# Altium schematic sheet JacDacRHTemp 18.SchDoc: Complete design
size A4; DocumentNumber: 1; SheetNumber: 1; SheetTotal: 2; VersionControl_RevNumber: 1
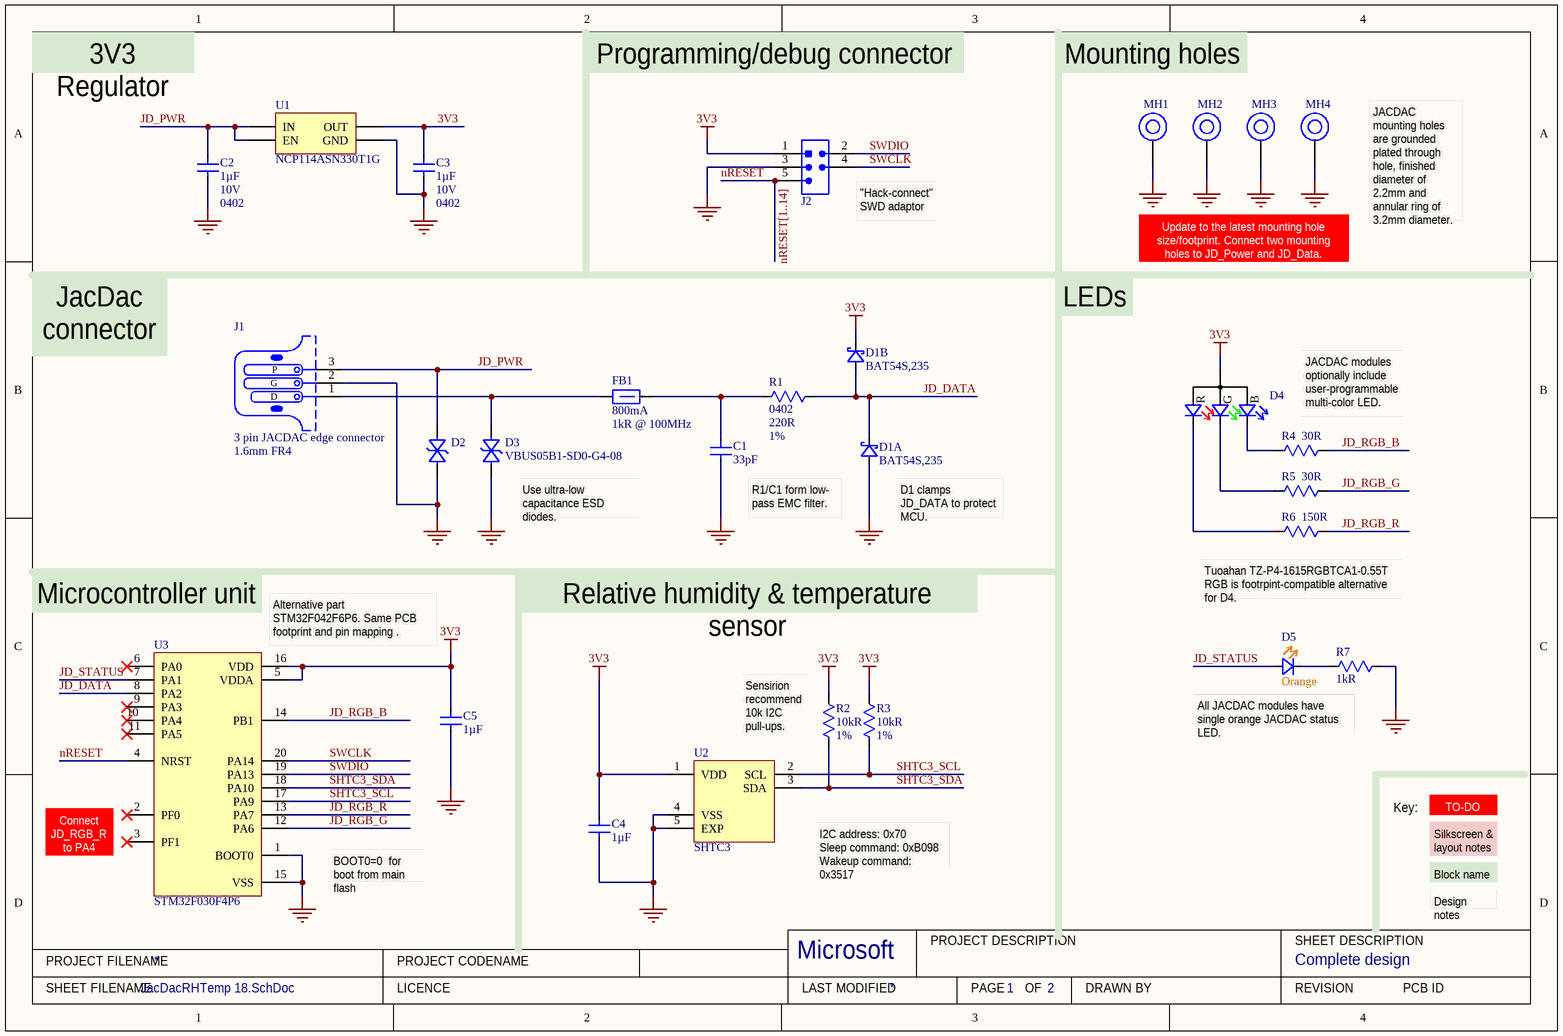
[diagram p0: JacDacRHTemp 18.SchDoc]

## Parts
C1  Capacitance: 33pF  [C0402_0.55MM - without outline]  (hidden comment: CL05C330JB51PNC)
C2  Capacitance: 1µF  Voltage Rating: 10V  Case Code (Imperial): 0402  [C0402_0.55MM - without outline]  (hidden comment: CL05A105KP5NNNC)
C3  Capacitance: 1µF  Voltage Rating: 10V  Case Code (Imperial): 0402  [C0402_0.55MM - without outline]  (hidden comment: CL05A105KP5NNNC)
C4  Capacitance: 1µF  [C0402_0.55MM - without outline]  (hidden comment: CL05A105KP5NNNC)
C5  Capacitance: 1µF  [C0402_0.55MM - without outline]  (hidden comment: CL05A105KP5NNNC)
D1  Manufacturer Part Number: BAT54S,235  [NXP-BAT54S-TO-236AB]  (hidden comment: BAT54S)  (parts A,B of 2)
D2  VBUS05B1-SD0-G4-08  [0201-VBUS05B1-SD0-G4-08 - Without outline]  (value not drawn)
D3  VBUS05B1-SD0-G4-08  [0201-VBUS05B1-SD0-G4-08 - Without outline]
D4  HSMF-C114  [HSMF-C114]  (value not drawn)
D5  Colour: Orange  [Rohm SML-D12 Orange - without outline]  (hidden comment: SML-D12D)
FB1  Current Rating: 800mA  Impedance: 1kR @ 100MHz  [TDK MPZ1608 0.8mm - without outline]  (hidden comment: TDK MPZ1608S102ATA00)
J1  3 pin JACDAC edge connector  PCB Type: 1.6mm FR4  [JACDAC_EDGE_CONNECTOR_9.15MM_PCB_WIDE _without_MH]  (no BOM)
J2  Hack Connect Mini 1.27 mm pitch 2-row  [HACK_CONNECT_MINI_5_X_1_27]  (value not drawn)  (no BOM)
MH1  MH_3.9MMNC_2.2MMD  [MH_3.9MMC_2.2MMD_FULL_CIRCLE]  (value not drawn)  (no BOM)
MH2  MH_3.9MMNC_2.2MMD  [MH_3.9MMC_2.2MMD_FULL_CIRCLE]  (value not drawn)  (no BOM)
MH3  MH_3.9MMNC_2.2MMD  [MH_3.9MMC_2.2MMD_FULL_CIRCLE]  (value not drawn)  (no BOM)
MH4  MH_3.9MMNC_2.2MMD  [MH_3.9MMC_2.2MMD_FULL_CIRCLE]  (value not drawn)  (no BOM)
R1  Case Code (Imperial): 0402  Resistance: 220R  Tolerance: 1%  [R0402 - Without outline]  (hidden comment: RC0402FR-07220RL)
R2  Resistance: 10kR  Tolerance: 1%  [R0402 - Without outline]  (hidden comment: 10k)
R3  Resistance: 10kR  Tolerance: 1%  [R0402 - Without outline]  (hidden comment: 10k)
R4  Resistance: 30R  [R0402 - Without outline]  (hidden comment: RC0402FR-0730RL)
R5  Resistance: 30R  [R0402 - Without outline]  (hidden comment: RC0402FR-0730RL)
R6  Resistance: 150R  [R0402 - Without outline]  (hidden comment: RC0402FR-07150RL)
R7  Resistance: 1kR  [R0402 - Without outline]  (hidden comment: RC0402FR-071KL)
U1  LDO 3.3V/300 mA  [ON_SEMI-SOT23-5]  (value not drawn)
U2  SHTC3  [SHTC3_4_WDFN]
U3  STM32F030F4P6  [20-TSSOP]

## Nets
3V3: C3.2 C4.2 C5.2 D1.2(K) D4.1(A) J2.1(VCC) R2.1 R3.1 U1.5(OUT) U2.1(VDD) U3.5(VDDA) U3.16(VDD)
GND: C1.1 C2.1 C3.1 C4.1 C5.1 D1.1(A) D2.2(A) D3.2(A) J1.2(G) J2.3(GND) MH1.1 MH2.1 MH3.1 MH4.1 R7.1 U1.2(GND) U2.4(VSS) U2.5(EXP) U3.1(BOOT0) U3.15(VSS)
JD_DATA: D1.3(K) R1.1 U3.8(PA2)
JD_PWR: C2.2 D2.1(K) J1.3(P) U1.1(IN) U1.3(EN)
JD_RGB_B: R4.2 U3.14(PB1)
JD_RGB_G: R5.2 U3.12(PA6)
JD_RGB_R: R6.2 U3.13(PA7)
JD_STATUS: D5.2(A) U3.7(PA1)
nRESET: J2.5(RESET) U3.4(NRST)  [also labelled nRESET[1..14]]
SHTC3_SCL: R3.2 U2.2(SCL) U3.17(PA9)
SHTC3_SDA: R2.2 U2.3(SDA) U3.18(PA10)
SWCLK: J2.4(SWCLK) U3.20(PA14)
SWDIO: J2.2(SWDIO) U3.19(PA13)
NetC1_2: C1.2 FB1.2 R1.2
NetD3_1: D3.1(K) FB1.1 J1.1(D)
NetD4_2: D4.2(R) R6.1
NetD4_3: D4.3(G) R5.1
NetD4_4: D4.4(B) R4.1
NetD5_1: D5.1(K) R7.2

Not connected (* = marked no-connect by the designer): U3 2(PF0)* 3(PF1)* 6(PA0)* 9(PA3)* 10(PA4)* 11(PA5)*

## Notes on the sheet
- 3V3 Regulator
- Programming/debug connector
- Mounting holes
- (near J2) "Hack-connect" SWD adaptor
- JACDAC mounting holes are grounded plated through hole, finished diameter of 2.2mm and annular ring of 3.2mm diameter.
- LEDs
- Update to the latest mounting hole size/footprint. Connect two mounting holes to JD_Power and JD_Data.
- JacDac
  connector
- JACDAC modules optionally include user-programmable multi-color LED.
- (near D3) Use ultra-low capacitance ESD diodes.
- R1/C1 form low-
  pass EMC filter.
- (near D1) D1 clamps JD_DATA to protect MCU.
- Microcontroller unit
- (near U3) Alternative part STM32F042F6P6. Same PCB footprint and pin mapping .
- Relative humidity & temperature sensor
- (near R6) Tuoahan TZ-P4-1615RGBTCA1-0.55T RGB is footrpint-compatible alternative for D4.
- Sensirion recommend 10k I2C pull-ups.
- All JACDAC modules have single orange JACDAC status LED.
- (near U3) Connect JD_RGB_R to PA4
- Key:
- TO-DO
- Silkscreen & layout notes
- BOOT0=0  for boot from main flash
- (near U2) I2C address: 0x70
  Sleep command: 0xB098
  Wakeup command: 0x3517
- Block name
- Design notes
- PROJECT FILENAME
- PROJECT CODENAME
- Microsoft
- PROJECT DESCRIPTION
- SHEET DESCRIPTION
- SHEET FILENAME
- LICENCE
- LAST MODIFIED
- PAGE
- OF
- DRAWN BY
- REVISION
- PCB ID

## Library data of the parts
C1 = CL05C330JB51PNC: CAP CER 33PF 50V NP0 0402; Manufacturer: Samsung; Tolerance: 5%; Supplier 1: Digi-Key; Manufacturer Part Number: CL05C330JB51PNC; RoHS: Yes; Category: Capacitors; Stock 1: 250654; Pricing 1: 1=0.10000, 10=0.07500, 50=0.04060, 100=0.03320, 500=0.02374, 1000=0.01865, 2500=0.01696, 5000=0.01560 (USD); Mount: Surface Mount; Case/Package: 0402; Case Code (Metric): 1005; Min Operating Temperature: -55°C; Max Operating Temperature: 125°C; Packaging: Tape and Reel; Length: 0.039inch; Width: 0.02inch; Thickness: 0.022inch; Ratings: AEC-Q200; Lead Free: Lead Free; ComponentLink1URL: http://www.samsungsem.com/kr/support/library/product-catalog/mlcc.jsp; ComponentLink1Description: Samsung datasheet online; Supplier 2: Mouser; Stock 2: 97900; Pricing 2: 1=0.11000, 10=0.08200, 100=0.03600, 500=0.02600, 1000=0.02000, 2500=0.01800 (USD); Supplier 3: Future Electronics; Stock 3: 100000; Pricing 3: 10000=0.00780 (USD); Supplier Part Number 3: 6022520; Supplier Part Number 2: 187-CL05C330JB51PNC; Checked: ?; Created: DG; Supplier Part Number 1: 1276-6515-1-ND; Voltage Rating: 50V; Case Code (Imperial): 0402
C2-C5 = CL05A105KP5NNNC: CAP CER 1UF 10V X5R 0402; Manufacturer: Samsung; Material: Ceramic; Tolerance: 10%; Supplier 1: Digi-Key; Manufacturer Part Number: CL05A105KP5NNNC; RoHS: Yes; Category: Capacitors; Stock 1: 5705569; Pricing 1: 1=0.10000, 10=0.03900, 50=0.02100, 100=0.01720, 500=0.01228, 1000=0.00965, 2500=0.00877, 5000=0.00807 (USD); Mount: Surface Mount; Case/Package: 0402; Case Code (Metric): 1005; Contact Plating: Tin; Min Operating Temperature: -55°C; Max Operating Temperature: 85°C; Dielectric: X5R; Package Quantity: 1; Packaging: Tape and Reel; Length: 1mm; Height: 0.5mm; Width: 0.02inch; Thickness: 0.022inch; Depth: 0.5mm; Radiation Hardening: No; ComponentLink1URL: https://datasheet.ciiva.com/15195/getdatasheetpartid-358390-15195630.pdf; ComponentLink1Description: Online datasheet; Supplier 2: Mouser; Stock 2: 928941; Pricing 2: 1=0.10000, 10=0.04200, 100=0.01800, 500=0.01300, 1000=0.01000, 2500=0.00900 (USD); Supplier 3: Farnell; Stock 3: 53670; Pricing 3: 10=0.02450, 100=0.02000, 500=0.01310, 2500=0.00920, 5000=0.00810, 10000=0.00640, 50000=0.00490 (GBP); Supplier Part Number 3: 3013329; Supplier Part Number 2: 187-CL05A105KP5NNNC; Supplier Part Number 1: 1276-1076-1-ND; Created: DG; Checked: ?
  C4 C5: Voltage Rating: 10V; Case Code (Imperial): 0402
D1 = BAT54S: DIODE ARRAY SCHOTTKY 30V SOT23; Manufacturer: Nexperia; Supplier 1: Digi-Key; RoHS: No; Category: Rectifier Diodes; Stock 1: 14011; Pricing 1: 1=0.13000, 10=0.11900, 100=0.05610, 500=0.03326, 1000=0.02185, 5000=0.02138 (USD); ComponentLink1URL: https://assets.nexperia.com/documents/data-sheet/BAT54_SER.pdf; ComponentLink1Description: NXP datasheet online; Supplier 2: Mouser; Supplier 3: RSComponents; Supplier Part Number 2: 771-BAT54S235; Supplier Part Number 3: 1707990; Supplier Part Number 1: 1727-1868-1-ND
D2 D3 = VBUS05B1-SD0-G4-08: TVS DIODE 5.5V 18V CLP0603; Manufacturer: Vishay Semiconductors; Peak Pulse Current: 2.5A; Number of Bidirectional Channels: 1; Min Breakdown Voltage: 6V; Peak Pulse Power: 45W; Power Line Protection: No; Direction: Bidirectional; Capacitance: 0.4pF; Element Configuration: Single; Supplier 1: Digi-Key; RoHS: Yes; Category: TVS Diodes; Stock 1: 22028; Pricing 1: 1=0.27000, 10=0.18500, 100=0.09020, 500=0.07524, 1000=0.05228, 2000=0.04531, 5000=0.04203 (USD); Mount: Surface Mount; Case/Package: 0201; Number of Pins: 2; Case Code (Metric): 0603; Case Code (Imperial): 0201; Min Operating Temperature: -55°C; Max Operating Temperature: 150°C; Packaging: Tape and Reel; Reverse Standoff Voltage: 5.5V; Clamping Voltage: 18V; Working Voltage: 5.5V; Resistor Type: Zener; ComponentLink2URL: http://www.vishay.com/docs/85899/vbus05b1-sd0.pdf; ComponentLink2Description: Online datasheet; Supplier 2: Farnell; Stock 2: 13100; Pricing 2: 5=0.20800, 10=0.14000, 100=0.06340, 500=0.05020, 1000=0.04160, 5000=0.03300 (GBP); Supplier 3: Mouser; Stock 3: 1209; Pricing 3: 1=0.27000, 10=0.18500, 50=0.18500, 100=0.09300, 1000=0.03900, 10000=0.03400 (USD); Supplier 4: Arrow Electronics; Stock 4: 719; Pricing 4: 1=0.17630, 10=0.14370, 25=0.14230, 100=0.07810, 250=0.07660, 500=0.06310, 15000=0.02980, 150000=0.02970, 1500000=0.02870, 7500000=0.02800 (USD); Supplier Part Number 4: VBUS05B1-SD0-G4-08; Supplier Part Number 3: 78-VBUS05B1SD0-G4-08; Supplier Part Number 1: VBUS05B1-SD0-G4-08GICT-ND; Supplier Part Number 2: 2932858; Created By: D. Gakure; Checked By: ?; Manufacturer Part Number: VBUS05B1-SD0-G4-08
D4 = HSMF-C114: Red, Green, Blue (RGB) 626nm Red, 525nm Green, 470nm Blue LED Indication - Discrete 1.9V Red, 3.4V Green, 3.4V Blue 0606 (1616 Metric); Manufacturer: Broadcom Avago; Color: Blue,Green,Red; Lens Color: White; Viewing Angle: 145°; Luminous Intensity: 70mcd; Lens Style: Diffused,Rectangular; Forward Current: 20mA; Lens Transparency: Diffused; Number of Elements: 3; Reverse Voltage: 5V; Power Rating: 78mW; Supplier 1: Digi-Key; Manufacturer Part Number: HSMF-C114; RoHS: Yes; Category: Optoelectronics; Stock 1: 20555; Pricing 1: 1=1.78000, 10=1.12500, 100=0.83250, 500=0.76500, 1000=0.63000, 2000=0.59850 (USD); Mount: Surface Mount; Case/Package: 0606; Number of Pins: 4; Case Code (Metric): 1616; Case Code (Imperial): 0606; Min Operating Temperature: -40°C; Max Operating Temperature: 85°C; Forward Voltage: 3.4V; Packaging: Tape and Reel; Wavelength: 470nm; Package Quantity: 4000; Dominant Wavelength: 470nm; Test Current: 20mA; Number of LEDs: 3; Length: 1.6mm; Width: 1.5mm; Height: 0.35mm; Depth: 1.6mm; Radiation Hardening: No; REACH SVHC: No SVHC; Lead Free: Lead Free; Supplier 2: Farnell; Stock 2: 8134; Pricing 2: 1=1.56000, 10=0.97100, 25=0.87800, 50=0.78500, 100=0.69200, 500=0.60500 (GBP); Supplier 3: Mouser; Stock 3: 14991; Pricing 3: 1=1.69000, 10=1.13000, 50=1.13000, 100=0.85600, 1000=0.74800, 10000=0.74800 (USD); Supplier Part Number 1: 516-1795-1-ND; Supplier Part Number 3: 630-HSMF-C114; Supplier Part Number 2: 1058362; ComponentLink1Description: Online datasheet; ComponentLink1URL: https://docs.broadcom.com/docs/AV02-2451EN; Created By: D. Gakure; Checked By: ?
D5 = SML-D12D: 1.6 x 0.8 x 0.55mm (0603) LED 605nm Orange; Manufacturer: Rohm Semiconductor; Manufacturer Part Number: SML-D12D8WT86; Millicandela Rating: 100mcd; Voltage - Forward (Vf) (Typ): 2.2V; Current - Test: 20mA; Lens Type: Diffused, White; Lens Style/Size: Rectangle with Flat Top, 1.2mm x 0.8mm; Supplier 1: Digi-Key; RoHS: RoHS Compliant; Category: Optoelectronics; Stock 1: 1719; Pricing 1: 1=0.38, 10=0.279, 25=0.2232, 100=0.1478, 250=0.1046, 500=0.08926, 1000=0.06974 (GBP); Packaging: Cut Tape (CT); Wavelength - Dominant: 605nm; Wavelength - Peak: -; Viewing Angle: -; Package / Case: 0603 (1608 Metric); Size / Dimension: 1.60mm L x 0.80mm W; Height: 0.55mm; Mounting Type: Surface Mount; Luminous Flux @ Current - Test: -; ComponentLink1URL: https://d1d2qsbl8m0m72.cloudfront.net/en/products/databook/datasheet/opto/led/chip_mono/sml-d12x8_d13x8-e.pdf; ComponentLink1Description: Online datasheet; Supplier Part Number 1: 511-1577-1-ND
FB1 = TDK MPZ1608S102ATA00: 0603 1k@100MHz 0.8A chip; Core Material: Ferrite; Tolerance: 25%; DC Resistance (DCR): 300mR; Supplier 1: Digi-Key; Stock 1: 113542; Pricing 1: 1=0.1, 10=0.079, 25=0.0716, 50=0.0644, 100=0.0472, 250=0.03432, 500=0.03146, 1000=0.02717 (USD); Mount: Surface Mount; Case/Package: 0603; Case Code (Metric): 1608; Case Code (Imperial): 0603; Package Quantity: 4000; Packaging: Tape and Reel; Max DC Current: 800mA; Length: 0.063inch; Height: 0.037inch; Width: 0.031inch; ComponentLink2URL: https://www.mouser.co.uk/datasheet/2/400/eads_commercial_power_mpz1608_en-923650.pdf; ComponentLink2Description: datasheet online; Supplier 2: Mouser; ComponentLink3Description: datasheet; ComponentLink3URL: Y:\System\Altium\Libraries 2014\TDK\Datasheets\eads_commercial_power_mpz1608_en-923650.pdf; Supplier Part Number 1: 445-8694-1-ND; Supplier Part Number 2: 810-MPZ1608S102ATA00; Manufacturer: TDK; Manufacturer Part Number: MPZ1608S102ATA00
J1 = JACDAC edge connector: 3 pin JACDAC edge connector 1.27mm pitch; Manufacturer Part Number: JACDAC_EDGE_CONNECTOR; Checked By: ?; Created By: D. Gakure; ComponentLink1Description: Yuliang JACDAC cable connector drawing online; ComponentLink1URL: https://github.com/microsoft/jacdac-mdk/blob/main/connector/JACDAC-Connector-by-Yuliang-2020-11-28.pdf; ComponentLink2Description: JACDAC PCB edge connector spec onlin; ComponentLink2URL: https://github.com/microsoft/jacdac-mdk/blob/main/connector/JACDAC_PCB_Edge_Connector_Drawing_JD-PEC-01_rev_01.pdf
J2 = HACK_CONNECT_MINI
MH1-MH4 = MH_3.9MMNC_2.2MMD_FULL_CIR: Mounting Hole 3.9mm Diameter with 3.2 annualar ring, 2.2mm Drill PTH
R1 = RC0402FR-07220RL: RES SMD 220 OHM 1% 1/16W 0402; Manufacturer: Yageo; Power Rating: 62.5mW; Voltage Rating: 50V; Temperature Coefficient: 100ppm/°C; Max Power Dissipation: 63mW; Supplier 1: Digi-Key; Manufacturer Part Number: RC0402FR-07220RL; RoHS: Yes; Category: Resistors; Stock 1: 1286042; Pricing 1: 1=0.10000, 10=0.01400, 100=0.00580, 1000=0.00262, 2500=0.00228, 5000=0.00188 (USD); Case/Package: 0402; Number of Pins: 2; Case Code (Metric): 1005; Min Operating Temperature: -55°C; Max Operating Temperature: 155°C; Packaging: Tape and Reel; Voltage Rating (DC): 50V; Package Quantity: 1; Termination: SMD/SMT; Resistor Type: Thick Film; Number of Terminations: 2; Features: Moisture Resistant; Length: 1mm; Height: 0.016inch; Width: 0.02inch; Depth: 0.5mm; REACH SVHC: No SVHC; Military Standard: Not; Lead Free: Lead Free; ComponentLink1URL: https://datasheet.ciiva.com/11819/0900766b80c66297-11819466.pdf?src-supplier=RSComponents; ComponentLink1Description: https://datasheet.ciiva.com/11819/0900766b80c66297-11819466.pdf?src-supplier=RSComponents; ComponentLink2URL: https://datasheet.ciiva.com/2453/pyu-r-int-thick-7-2453460.pdf?src-supplier=Digi-Key; ComponentLink2Description: https://datasheet.ciiva.com/2453/pyu-r-int-thick-7-2453460.pdf?src-supplier=Digi-Key; ComponentLink3URL: https://datasheet.ciiva.com/2453/pyu-r-int-thick-7-2453461.pdf?src-supplier=Digi-Key; ComponentLink3Description: https://datasheet.ciiva.com/2453/pyu-r-int-thick-7-2453461.pdf?src-supplier=Digi-Key; ComponentLink4URL: https://datasheet.ciiva.com/2453/pyu-r-int-thick-7-2453462.pdf?src-supplier=Digi-Key; ComponentLink4Description: https://datasheet.ciiva.com/2453/pyu-r-int-thick-7-2453462.pdf?src-supplier=Digi-Key; ComponentLink5URL: https://datasheet.ciiva.com/16746/pyu-rc0402-51-rohs-l-6-r-16746831.pdf?src-supplier=Future+Electronics; ComponentLink5Description: https://datasheet.ciiva.com/16746/pyu-rc0402-51-rohs-l-6-r-16746831.pdf?src-supplier=Future+Electronics; Supplier 2: Mouser; Stock 2: 324625; Pricing 2: 1=0.10000, 10=0.01200, 100=0.00400, 1000=0.00400, 2500=0.00400, 10000=0.00300 (USD); Supplier 3: Farnell; Stock 3: 18234; Pricing 3: 1=0.08130, 25=0.01210, 100=0.01120, 250=0.01030, 500=0.00900 (GBP); Supplier Part Number 3: 2147864; Supplier Part Number 2: 603-RC0402FR-07220RL; Supplier Part Number 1: 311-220LRCT-ND; Created: D.G; Checked: ?
R2 R3 = RC0402FR-0710KL: RES SMD 10K OHM 1% 1/16W 0402; Manufacturer: Yageo; Temperature Coefficient: 100ppm/°C; Voltage Rating (DC): 50V; Power Rating: 62.5mW; Supplier 1: Digi-Key; Manufacturer Part Number: RC0402FR-0710KL; RoHS: Yes; Category: Resistors; Stock 1: 40173593; Pricing 1: 1=0.10000, 10=0.01400, 100=0.00580, 1000=0.00262, 2500=0.00228, 5000=0.00188 (USD); Case/Package: 0402; Number of Pins: 2; Case Code (Metric): 1005; Min Operating Temperature: -55°C; Max Operating Temperature: 155°C; Resistor Type: Thick Film; Packaging: Tape and Reel; Voltage Rating: 50V; Termination: SMD/SMT; Working Voltage: 50V; Number of Terminations: 2; Length: 1mm; Height: 0.32mm; Width: 0.5mm; Depth: 0.5mm; Lead Pitch: 0.2mm; REACH SVHC: No SVHC; Lead Free: Lead Free; Military Standard: Not; ComponentLink1URL: https://datasheet.ciiva.com/7660/38568-7660787.pdf?src-supplier=Element14; ComponentLink1Description: https://datasheet.ciiva.com/7660/38568-7660787.pdf?src-supplier=Element14; ComponentLink2URL: https://datasheet.ciiva.com/7849/1784430-7849813.pdf?src-supplier=Element14; ComponentLink2Description: https://datasheet.ciiva.com/7849/1784430-7849813.pdf?src-supplier=Element14; ComponentLink3URL: https://datasheet.ciiva.com/7849/1686128-7849814.pdf?src-supplier=Element14; ComponentLink3Description: https://datasheet.ciiva.com/7849/1686128-7849814.pdf?src-supplier=Element14; ComponentLink4URL: https://datasheet.ciiva.com/7849/1784430-7849815.pdf?src-supplier=Element14; ComponentLink4Description: https://datasheet.ciiva.com/7849/1784430-7849815.pdf?src-supplier=Element14; ComponentLink5URL: https://datasheet.ciiva.com/22747/1018594-22747512.pdf?src-supplier=Element14; ComponentLink5Description: https://datasheet.ciiva.com/22747/1018594-22747512.pdf?src-supplier=Element14; ComponentLink6URL: https://datasheet.ciiva.com/12667/pyu-rc0402-51-rohs-l-6-r-12667067.pdf?src-supplier=Mouser; ComponentLink6Description: https://datasheet.ciiva.com/12667/pyu-rc0402-51-rohs-l-6-r-12667067.pdf?src-supplier=Mouser; ComponentLink7URL: https://datasheet.ciiva.com/7983/1018594-7983486.pdf?src-supplier=Element14; ComponentLink7Description: https://datasheet.ciiva.com/7983/1018594-7983486.pdf?src-supplier=Element14; Supplier 2: Mouser; Stock 2: 23672167; Pricing 2: 1=0.10000, 10=0.01300, 100=0.00400, 1000=0.00300, 2500=0.00300, 10000=0.00200 (USD); Supplier 3: Farnell; Stock 3: 370000; Pricing 3: 10000=0.00350 (GBP); Checked: ?; Created: DG; Supplier Part Number 1: 311-10.0KLRCT-ND; Supplier Part Number 2: 603-RC0402FR-0710KL; Supplier Part Number 3: 2363463; Case Code (Imperial): 0402
R4 R5 = RC0402FR-0730RL: RES SMD 30 OHM 1% 1/16W 0402; Manufacturer: Yageo; Temperature Coefficient: 100ppm/°C; Power Rating: 63mW; Voltage Rating: 50V; Supplier 1: Digi-Key; Manufacturer Part Number: RC0402FR-0730RL; RoHS: Yes; Category: Chip SMD Resistors; Stock 1: 2973; Pricing 1: 1=0.10000, 10=0.01400, 100=0.00580, 1000=0.00260, 2500=0.00226, 5000=0.00186 (USD); Case/Package: 0402; Contact Plating: Tin,Matte; Case Code (Metric): 1005; Size Code: 0402; Min Operating Temperature: -55°C; Max Operating Temperature: 155°C; Resistor Type: Thick Film; Packaging: Tape and Reel; Termination: SMD/SMT; Voltage Rating (DC): 50V; Features: Moisture Resistant; Series: RC; Max Power Dissipation: 63mW; Number of Terminations: 2; Construction: Rectangular; Resistance Tolerance: 1%; Length: 1mm; Width: 0.5mm; Height: 0.35mm; Depth: 0.5mm; REACH SVHC: Unknown; Military Standard: Not; Lead Free: Lead Free; RoHS Compliant: Yes; ComponentLink1URL: https://datasheet.ciiva.com/7849/1018594-7849958.pdf; ComponentLink1Description: Online datasheet; Supplier 2: Mouser; Stock 2: 41804; Pricing 2: 1=0.10000, 10=0.01200, 50=0.01200, 100=0.00400, 1000=0.00400, 10000=0.00300 (USD); Supplier 3: Farnell; Stock 3: 4422; Pricing 3: 10=0.01210, 100=0.00420, 500=0.00370, 2500=0.00280, 5000=0.00250, 10000=0.00230, 50000=0.00150 (GBP); Supplier Part Number 3: 1458775; Supplier Part Number 2: 603-RC0402FR-0730RL; Supplier Part Number 1: 311-30LRCT-ND; Created By: D. Gakure; Checked By: ?; Tolerance: 1%; Case Code (Imperial): 0402
R6 = RC0402FR-07150RL: RES SMD 150 OHM 1% 1/16W 0402; Manufacturer: Yageo; Power Rating: 62.5mW; Voltage Rating: 50V; Temperature Coefficient: 100ppm/°C; Max Power Dissipation: 63mW; Supplier 1: Digi-Key; Manufacturer Part Number: RC0402FR-07150RL; RoHS: Yes; Category: Chip SMD Resistors; Stock 1: 5214533; Pricing 1: 1=0.10000, 10=0.01400, 100=0.00580, 1000=0.00260, 2500=0.00226, 5000=0.00186 (USD); Case/Package: 0402; Case Code (Metric): 1005; Min Operating Temperature: -55°C; Max Operating Temperature: 155°C; Packaging: Tape and Reel; Package Quantity: 1; Resistor Type: Thick Film; Number of Terminations: 2; Termination: SMD/SMT; Working Voltage: 50V; Features: Moisture Resistant; Series: RC; Resistance Tolerance: 1%; Construction: Rectangular; Technology: THICK FILM; Length: 1mm; Width: 0.02inch; Height: 0.016inch; Depth: 0.5mm; REACH SVHC: No SVHC; Military Standard: Not; Lead Free: Lead Free; RoHS Compliant: Yes; ComponentLink1URL: https://datasheet.ciiva.com/11808/0900766b80c66297-11808422.pdf; ComponentLink1Description: ine datasheet; Supplier 2: Mouser; Stock 2: 582717; Pricing 2: 1=0.10000, 10=0.01200, 50=0.01200, 100=0.00400, 1000=0.00400, 10000=0.00300 (USD); Supplier 3: Farnell; Stock 3: 880000; Pricing 3: 10000=0.00270, 50000=0.00200 (GBP); Created by: D. Gakure; Checked By: ?; Supplier Part Number 3: 2421893; Supplier Part Number 2: 603-RC0402FR-07150RL; Supplier Part Number 1: 311-150LRCT-ND; Tolerance: 1%; Case Code (Imperial): 0402
R7 = RC0402FR-071KL: RES SMD 1K OHM 1% 1/16W 0402; Manufacturer: Yageo; Temperature Coefficient: 100ppm/°C; Voltage Rating (DC): 50V; Power Rating: 62.5mW; Supplier 1: Digi-Key; Manufacturer Part Number: RC0402FR-071KL; RoHS: Yes; Category: Resistors; Stock 1: 37591306; Pricing 1: 1=0.10000, 10=0.01400, 100=0.00580, 1000=0.00262, 2500=0.00228, 5000=0.00188 (USD); Case/Package: 0402; Number of Pins: 2; Case Code (Imperial): 0402; Case Code (Metric): 1005; Min Operating Temperature: -55°C; Max Operating Temperature: 155°C; Resistor Type: Thick Film; Tolerance: 1%; Packaging: Tape and Reel; Voltage Rating: 50V; Termination: SMD/SMT; Length: 1mm; Height: 0.32mm; Width: 0.5mm; Depth: 0.5mm; REACH SVHC: Unknown; Lead Free: Lead Free; Military Standard: Not; ComponentLink2URL: https://datasheet.ciiva.com/12666/pyu-rc0402-51-rohs-l-6-r-12666741.pdf; ComponentLink2Description: Online datasheet; Supplier 2: Mouser; Stock 2: 11912978; Pricing 2: 1=0.10000, 10=0.01200, 100=0.00400, 1000=0.00400, 2500=0.00400, 10000=0.00300 (USD); Supplier 3: Farnell; Stock 3: 29900; Pricing 3: 1=0.08130, 25=0.01210, 100=0.01120, 250=0.01030, 500=0.00900 (GBP); Supplier Part Number 3: 2132441; Supplier Part Number 2: 603-RC0402FR-071KL; Supplier Part Number 1: 311-1.00KLRDKR-ND; Created: D.G; Checked: ?
U1 = NCP114ASN330T1G: ON SEMICONDUCTOR - NCP114ASN330T1G - LDO Voltage Regulator, Fixed, 1.7 V to 5.5 V in, 3.3 V/300 mA out, 150 mV drop, TSOP-5; Output Current: 300mA; Output Configuration: Positive; Number of Regulators: 1; Max Input Voltage: 5.5V; Min Output Voltage: 3.3V; Dropout Voltage: 225mV; Quiescent Current: 95uA; Power Supply Rejection Ratio (PSRR): 75dB; Supplier 1: Digi-Key; RoHS: No; Category: Voltage Regulators - Linear; Stock 1: 32529; Pricing 1: 1=0.33000, 10=0.24900, 25=0.21760, 100=0.12440, 250=0.11664, 500=0.09330, 1000=0.07153 (USD); Mount: Surface Mount; Case/Package: SOT-23-5; Min Operating Temperature: -40°C; Max Operating Temperature: 85°C; Output Type: Fixed; Packaging: Cut Tape; Lead Free: Lead Free; ComponentLink3URL: http://www.onsemi.com/pub/Collateral/NCP114-D.PDF; ComponentLink3Description: On Semi datasheet online; Supplier 2: RSComponents; Supplier 3: Mouser; Supplier Part Number 3: 863-NCP114ASN330T1G; Supplier Part Number 2: 1263178; Supplier Part Number 1: NCP114ASN330T1GOSCT-ND; Created: DG; Checked: ?; Manufacturer: ON Semiconductor; Manufacturer Part Number: NCP114ASN330T1G
U2 = SHTC3: Humidity Temperature Sensor 0 ~ 100% RH I²C ±2% RH 8s Surface Mount; Manufacturer: Sensirion; Output Type: I2C; Supplier 1: Digi-Key; RoHS: No; Stock 1: 10507; Pricing 1: 1=2.98000, 5=2.76200, 10=2.29500, 25=1.91240, 50=1.70000, 100=1.61500, 500=1.36000, 1000=1.27500 (USD); Mount: Surface Mount; Case/Package: DFN; Min Operating Temperature: -40°C; Max Operating Temperature: 125°C; Packaging: Tape and Reel; Sensor Type: Temperature; Accuracy: 2%; Response Time: 8s; ComponentLink1URL: https://media.digikey.com/pdf/Data%20Sheets/Sensirion%20PDFs/HT_DS_SHTC3_D1.pdf; ComponentLink1Description: Online datasheet; Supplier 2: Mouser; Stock 2: 13209; Pricing 2: 1=2.44000, 10=2.03000, 50=1.50000, 100=1.43000, 1000=1.13000, 10000=0.93700 (USD); Supplier 3: Farnell; Stock 3: 3479; Pricing 3: 1=2.94000, 25=1.98000, 50=1.84000, 250=1.59000, 500=1.56000 (GBP); Supplier 4: RSComponents; Stock 4: 1085; Pricing 4: 2500=1.13700 (USD); Category: Sensors Transducers; Created By: D. Gakure; Checked By: ?; Supplier Part Number 4: 1950668; Supplier Part Number 3: 3106918; Supplier Part Number 2: 403-SHTC3; Supplier Part Number 1: 1649-1100-1-ND; Manufacturer Part Number: SHTC3
U3 = ST STM32F030F4P6: STMICROELECTRONICS - STM32F030F4P6 - 32 Bit Microcontroller, Value Line, ARM Cortex-M0, 48 MHz, 16 KB, 4 KB, 20, TSSOP RoHS Compliant: Yes; Max Supply Voltage: 3.6V; Frequency: 48MHz; Interface: I2C,SPI,UART,USART; RAM Size: 4KB; Max Power Dissipation: 182mW; Number of I/Os: 15; Number of Timers/Counters: 5; Min Supply Voltage: 2.4V; Number of ADC Channels: 16; Oscillator Type: Internal; Data Bus Width: 32b; Number of SPI Channels: 1; Memory Type: FLASH; Memory Size: 16KB; Peripherals: POR,PWM,WDT,DMA; Number of PWM Channels: 6; Categories: Integrated Circuits; Supplier 1: Farnell; Manufacturer: STMicroelectronics; RoHS: Yes; Category: Microcontrollers; Stock 1: 1196; Pricing 1: 1=0.97500, 25=0.85400, 50=0.75500, 100=0.65600, 250=0.61800, 500=0.58000, 1000=0.52500, 2500=0.46900 (GBP); Case/Package: TSSOP; Number of Pins: 20; Contact Plating: Gold; Min Operating Temperature: -40°C; Max Operating Temperature: 85°C; Package Quantity: 74; Packaging: Rail/Tube; Number of Programmable I/O: 15; Max Frequency: 48MHz; Number of I2C Channels: 1; Watchdog Timer: Yes; Core Architecture: ARM; Length: 6.6mm; Height: 1.05mm; Width: 4.5mm; Radiation Hardening: No; REACH SVHC: No SVHC; Lead Free: Lead Free; ComponentLink1URL: https://datasheet.ciiva.com/29720/dm00088500-29720640.pdf; ComponentLink1Description: Online datasheet; Supplier Part Number 1: 2393635; Created: DG; Checked: ?; Supplier Part Number 2: 497-14044-5-ND; Supplier 2: Digi-Key; Supplier 3: RSComponents; Stock 3: 48; Pricing 3: 100=0.43900, 250=0.38800, 1000=0.37300 (GBP); Supplier Part Number 3: 7925925P; Manufacturer Part Number: STM32F030F4P6